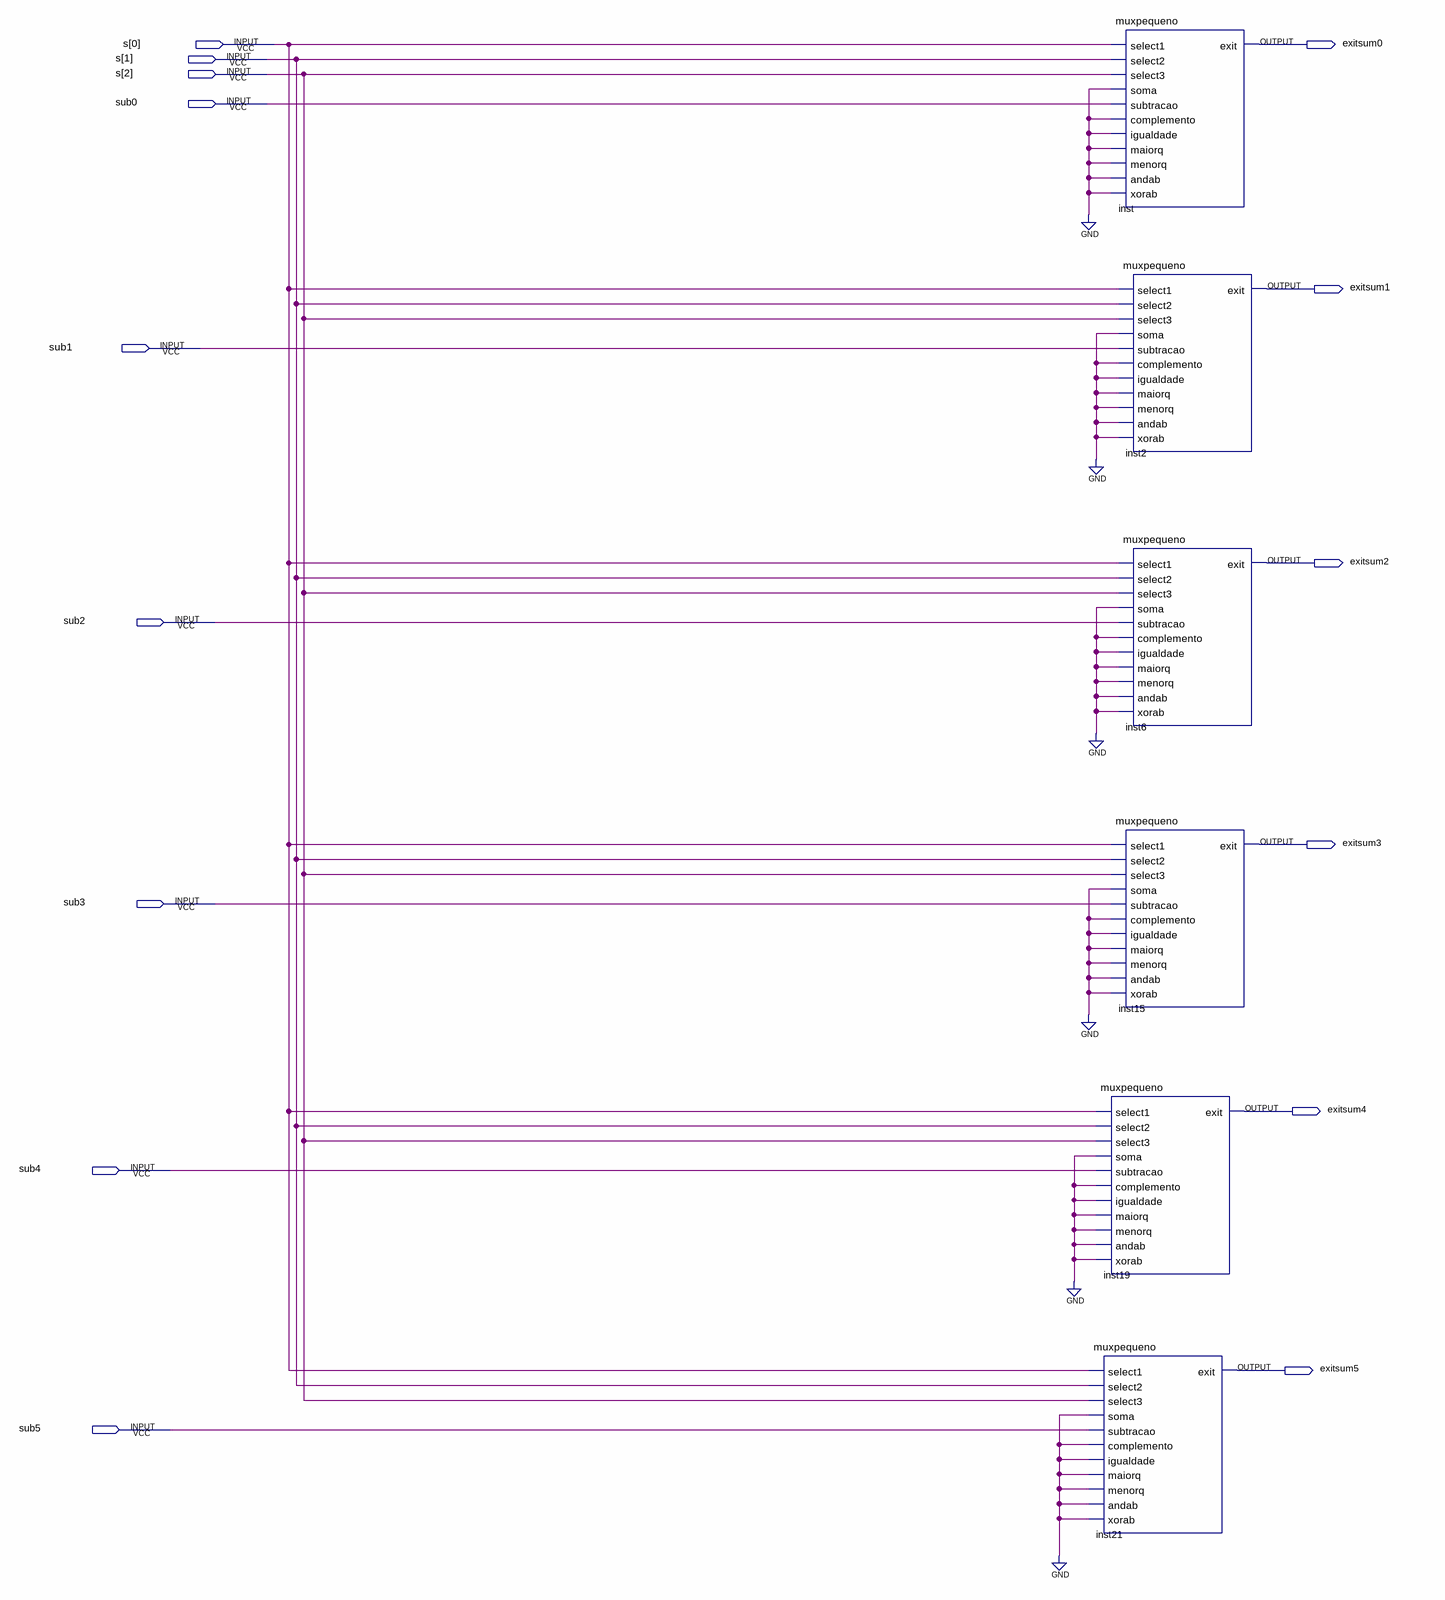
[diagram p0: schematic sheet]
// Quartus schematic muxsub.bdf as structural Verilog: 6 symbols, 15 pins
module muxsub (
  input  [2:0] s,
  input  sub0,
  input  sub1,
  input  sub2,
  input  sub3,
  input  sub4,
  input  sub5,
  output exitsum0,
  output exitsum1,
  output exitsum2,
  output exitsum3,
  output exitsum4,
  output exitsum5
);

  muxpequeno inst19 (
    .select1(s[0]), .select2(s[1]), .select3(s[2]), .soma(1'b0), .subtracao(sub4), .complemento(1'b0),
    .igualdade(1'b0), .maiorq(1'b0), .menorq(1'b0), .andab(1'b0), .xorab(1'b0), .exit(exitsum4));
  muxpequeno inst21 (
    .select1(s[0]), .select2(s[1]), .select3(s[2]), .soma(1'b0), .subtracao(sub5), .complemento(1'b0),
    .igualdade(1'b0), .maiorq(1'b0), .menorq(1'b0), .andab(1'b0), .xorab(1'b0), .exit(exitsum5));
  muxpequeno inst (
    .select1(s[0]), .select2(s[1]), .select3(s[2]), .soma(1'b0), .subtracao(sub0), .complemento(1'b0),
    .igualdade(1'b0), .maiorq(1'b0), .menorq(1'b0), .andab(1'b0), .xorab(1'b0), .exit(exitsum0));
  muxpequeno inst2 (
    .select1(s[0]), .select2(s[1]), .select3(s[2]), .soma(1'b0), .subtracao(sub1), .complemento(1'b0),
    .igualdade(1'b0), .maiorq(1'b0), .menorq(1'b0), .andab(1'b0), .xorab(1'b0), .exit(exitsum1));
  muxpequeno inst6 (
    .select1(s[0]), .select2(s[1]), .select3(s[2]), .soma(1'b0), .subtracao(sub2), .complemento(1'b0),
    .igualdade(1'b0), .maiorq(1'b0), .menorq(1'b0), .andab(1'b0), .xorab(1'b0), .exit(exitsum2));
  muxpequeno inst15 (
    .select1(s[0]), .select2(s[1]), .select3(s[2]), .soma(1'b0), .subtracao(sub3), .complemento(1'b0),
    .igualdade(1'b0), .maiorq(1'b0), .menorq(1'b0), .andab(1'b0), .xorab(1'b0), .exit(exitsum3));
endmodule
